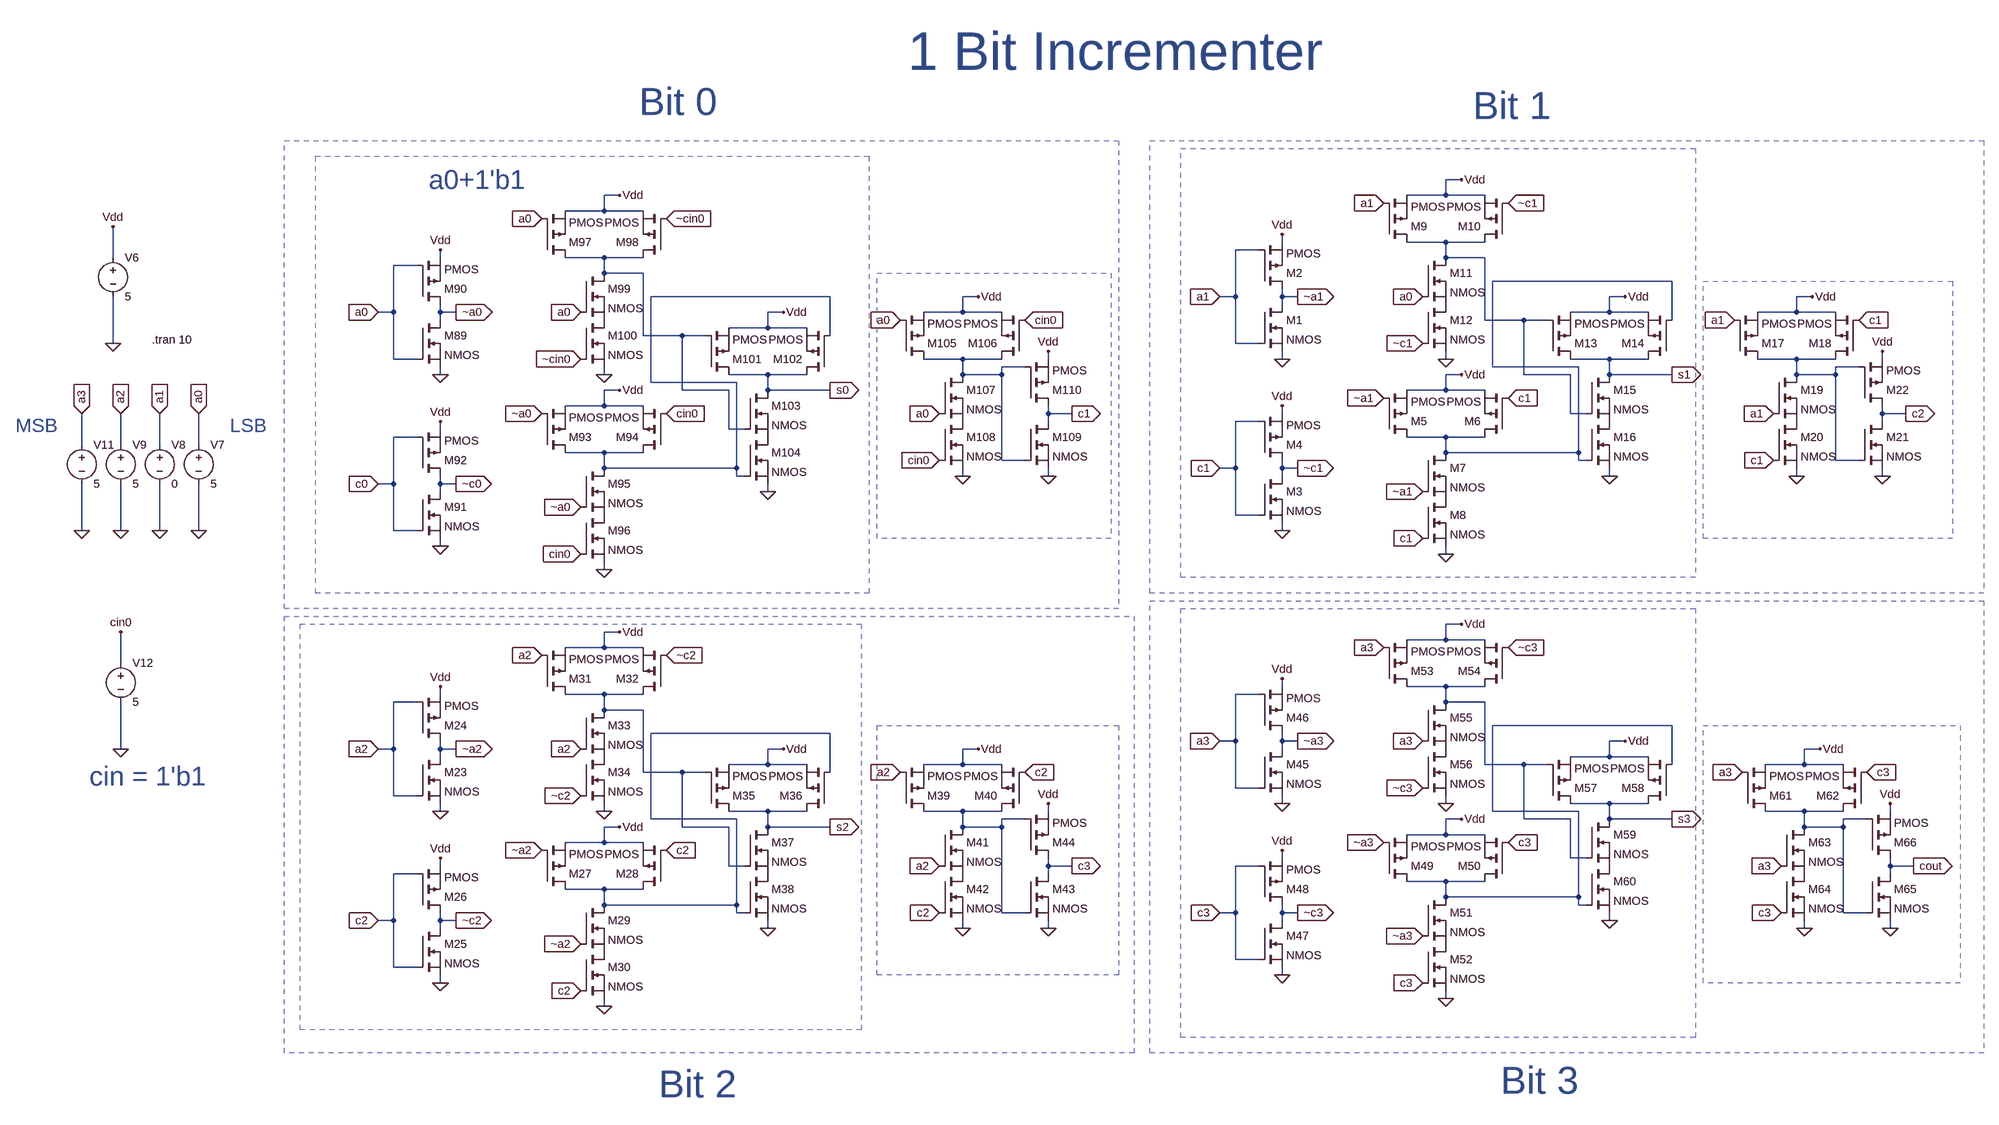
[diagram p0: schematic 1 bit Incrementer.asc]
1 bit Incrementer.asc, the LTspice schematic file:
Version 4
SHEET 1 2804 1276
WIRE 1728 -2720 1696 -2720
WIRE 0 -2688 -32 -2688
WIRE 1696 -2688 1696 -2720
WIRE 1696 -2688 1616 -2688
WIRE 1776 -2688 1696 -2688
WIRE -32 -2656 -32 -2688
WIRE -32 -2656 -112 -2656
WIRE 48 -2656 -32 -2656
WIRE 1360 -2592 1360 -2608
WIRE 1696 -2592 1616 -2592
WIRE 1776 -2592 1696 -2592
WIRE 1312 -2576 1264 -2576
WIRE -1040 -2560 -1040 -2624
WIRE -368 -2560 -368 -2576
WIRE -32 -2560 -112 -2560
WIRE 48 -2560 -32 -2560
WIRE 1696 -2560 1696 -2592
WIRE 1776 -2560 1696 -2560
WIRE -416 -2544 -464 -2544
WIRE -32 -2528 -32 -2560
WIRE 48 -2528 -32 -2528
WIRE 2160 -2512 1792 -2512
WIRE 432 -2480 64 -2480
WIRE 736 -2480 704 -2480
WIRE 1264 -2480 1264 -2576
WIRE 1264 -2480 1232 -2480
WIRE 1360 -2480 1360 -2496
WIRE 1392 -2480 1360 -2480
WIRE 2064 -2480 2032 -2480
WIRE 2448 -2480 2416 -2480
WIRE 1360 -2464 1360 -2480
WIRE -464 -2448 -464 -2544
WIRE -464 -2448 -496 -2448
WIRE -368 -2448 -368 -2464
WIRE -336 -2448 -368 -2448
WIRE 336 -2448 304 -2448
WIRE 704 -2448 704 -2480
WIRE 704 -2448 624 -2448
WIRE 784 -2448 704 -2448
WIRE 2032 -2448 2032 -2480
WIRE 2032 -2448 1952 -2448
WIRE 2112 -2448 2032 -2448
WIRE 2416 -2448 2416 -2480
WIRE 2416 -2448 2336 -2448
WIRE 2496 -2448 2416 -2448
WIRE -368 -2432 -368 -2448
WIRE 1776 -2432 1776 -2560
WIRE 1856 -2432 1776 -2432
WIRE 1904 -2432 1856 -2432
WIRE 2160 -2432 2160 -2512
WIRE 304 -2416 304 -2448
WIRE 304 -2416 224 -2416
WIRE 384 -2416 304 -2416
WIRE 48 -2400 48 -2528
WIRE 128 -2400 48 -2400
WIRE 176 -2400 128 -2400
WIRE 432 -2400 432 -2480
WIRE -1040 -2384 -1040 -2480
WIRE 1264 -2384 1264 -2480
WIRE 1312 -2384 1264 -2384
WIRE -464 -2352 -464 -2448
WIRE -416 -2352 -464 -2352
WIRE 704 -2352 624 -2352
WIRE 784 -2352 704 -2352
WIRE 880 -2352 880 -2368
WIRE 1360 -2352 1360 -2368
WIRE 1696 -2352 1696 -2368
WIRE 2032 -2352 1952 -2352
WIRE 2112 -2352 2032 -2352
WIRE 2416 -2352 2336 -2352
WIRE 2496 -2352 2416 -2352
WIRE 2592 -2352 2592 -2368
WIRE 832 -2336 784 -2336
WIRE 1792 -2336 1792 -2512
WIRE 1968 -2336 1792 -2336
WIRE 2544 -2336 2496 -2336
WIRE -368 -2320 -368 -2336
WIRE -32 -2320 -32 -2336
WIRE 304 -2320 224 -2320
WIRE 384 -2320 304 -2320
WIRE 704 -2320 704 -2352
WIRE 784 -2320 784 -2336
WIRE 784 -2320 704 -2320
WIRE 1728 -2320 1696 -2320
WIRE 1856 -2320 1856 -2432
WIRE 1952 -2320 1856 -2320
WIRE 2032 -2320 2032 -2352
WIRE 2160 -2320 2032 -2320
WIRE 2416 -2320 2416 -2352
WIRE 2496 -2320 2496 -2336
WIRE 2496 -2320 2416 -2320
WIRE 64 -2304 64 -2480
WIRE 240 -2304 64 -2304
WIRE 0 -2288 -32 -2288
WIRE 128 -2288 128 -2400
WIRE 224 -2288 128 -2288
WIRE 304 -2288 304 -2320
WIRE 432 -2288 304 -2288
WIRE 1696 -2288 1696 -2320
WIRE 1696 -2288 1616 -2288
WIRE 1776 -2288 1696 -2288
WIRE -32 -2256 -32 -2288
WIRE -32 -2256 -112 -2256
WIRE 48 -2256 -32 -2256
WIRE 880 -2240 880 -2256
WIRE 928 -2240 880 -2240
WIRE 1360 -2240 1360 -2256
WIRE 1952 -2240 1952 -2320
WIRE 1984 -2240 1952 -2240
WIRE 2592 -2240 2592 -2256
WIRE 2640 -2240 2592 -2240
WIRE 880 -2224 880 -2240
WIRE 1312 -2224 1264 -2224
WIRE 2592 -2224 2592 -2240
WIRE -368 -2208 -368 -2224
WIRE 224 -2208 224 -2288
WIRE 256 -2208 224 -2208
WIRE -416 -2192 -464 -2192
WIRE 1696 -2192 1616 -2192
WIRE 1776 -2192 1696 -2192
WIRE -1104 -2176 -1104 -2240
WIRE -1024 -2176 -1024 -2240
WIRE -944 -2176 -944 -2240
WIRE -864 -2176 -864 -2240
WIRE -32 -2160 -112 -2160
WIRE 48 -2160 -32 -2160
WIRE 1696 -2160 1696 -2192
WIRE 1968 -2160 1968 -2336
WIRE 1968 -2160 1696 -2160
WIRE 784 -2144 784 -2320
WIRE 832 -2144 784 -2144
WIRE 1968 -2144 1968 -2160
WIRE 1984 -2144 1968 -2144
WIRE 2496 -2144 2496 -2320
WIRE 2544 -2144 2496 -2144
WIRE -32 -2128 -32 -2160
WIRE 240 -2128 240 -2304
WIRE 240 -2128 -32 -2128
WIRE 1264 -2128 1264 -2224
WIRE 1264 -2128 1232 -2128
WIRE 1360 -2128 1360 -2144
WIRE 1392 -2128 1360 -2128
WIRE 240 -2112 240 -2128
WIRE 256 -2112 240 -2112
WIRE 704 -2112 704 -2128
WIRE 880 -2112 880 -2128
WIRE 1360 -2112 1360 -2128
WIRE 2032 -2112 2032 -2128
WIRE 2416 -2112 2416 -2128
WIRE 2592 -2112 2592 -2128
WIRE -464 -2096 -464 -2192
WIRE -464 -2096 -496 -2096
WIRE -368 -2096 -368 -2112
WIRE -336 -2096 -368 -2096
WIRE -368 -2080 -368 -2096
WIRE 304 -2080 304 -2096
WIRE 1264 -2032 1264 -2128
WIRE 1312 -2032 1264 -2032
WIRE -1104 -2000 -1104 -2096
WIRE -1024 -2000 -1024 -2096
WIRE -944 -2000 -944 -2096
WIRE -864 -2000 -864 -2096
WIRE -464 -2000 -464 -2096
WIRE -416 -2000 -464 -2000
WIRE 1360 -2000 1360 -2016
WIRE -368 -1968 -368 -1984
WIRE 1696 -1952 1696 -1968
WIRE -32 -1920 -32 -1936
WIRE 1728 -1808 1696 -1808
WIRE 0 -1792 -32 -1792
WIRE 1696 -1776 1696 -1808
WIRE 1696 -1776 1616 -1776
WIRE 1776 -1776 1696 -1776
WIRE -32 -1760 -32 -1792
WIRE -32 -1760 -112 -1760
WIRE 48 -1760 -32 -1760
WIRE -1024 -1728 -1024 -1792
WIRE 1360 -1680 1360 -1696
WIRE 1696 -1680 1616 -1680
WIRE 1776 -1680 1696 -1680
WIRE -368 -1664 -368 -1680
WIRE -32 -1664 -112 -1664
WIRE 48 -1664 -32 -1664
WIRE 1312 -1664 1264 -1664
WIRE -416 -1648 -464 -1648
WIRE 1696 -1648 1696 -1680
WIRE 1776 -1648 1696 -1648
WIRE -32 -1632 -32 -1664
WIRE 48 -1632 -32 -1632
WIRE 2160 -1600 1792 -1600
WIRE 432 -1584 64 -1584
WIRE 1264 -1568 1264 -1664
WIRE 1264 -1568 1232 -1568
WIRE 1360 -1568 1360 -1584
WIRE 1392 -1568 1360 -1568
WIRE 2064 -1568 2032 -1568
WIRE -1024 -1552 -1024 -1648
WIRE -464 -1552 -464 -1648
WIRE -464 -1552 -496 -1552
WIRE -368 -1552 -368 -1568
WIRE -336 -1552 -368 -1552
WIRE 336 -1552 304 -1552
WIRE 736 -1552 704 -1552
WIRE 1360 -1552 1360 -1568
WIRE 2464 -1552 2432 -1552
WIRE -368 -1536 -368 -1552
WIRE 2032 -1536 2032 -1568
WIRE 2032 -1536 1952 -1536
WIRE 2112 -1536 2032 -1536
WIRE 304 -1520 304 -1552
WIRE 304 -1520 224 -1520
WIRE 384 -1520 304 -1520
WIRE 704 -1520 704 -1552
WIRE 704 -1520 624 -1520
WIRE 784 -1520 704 -1520
WIRE 1776 -1520 1776 -1648
WIRE 1856 -1520 1776 -1520
WIRE 1904 -1520 1856 -1520
WIRE 2160 -1520 2160 -1600
WIRE 2432 -1520 2432 -1552
WIRE 2432 -1520 2352 -1520
WIRE 2512 -1520 2432 -1520
WIRE 48 -1504 48 -1632
WIRE 128 -1504 48 -1504
WIRE 176 -1504 128 -1504
WIRE 432 -1504 432 -1584
WIRE 1264 -1472 1264 -1568
WIRE 1312 -1472 1264 -1472
WIRE -464 -1456 -464 -1552
WIRE -416 -1456 -464 -1456
WIRE 1360 -1440 1360 -1456
WIRE 1696 -1440 1696 -1456
WIRE 2032 -1440 1952 -1440
WIRE 2112 -1440 2032 -1440
WIRE -368 -1424 -368 -1440
WIRE -32 -1424 -32 -1440
WIRE 304 -1424 224 -1424
WIRE 384 -1424 304 -1424
WIRE 704 -1424 624 -1424
WIRE 784 -1424 704 -1424
WIRE 880 -1424 880 -1440
WIRE 1792 -1424 1792 -1600
WIRE 1968 -1424 1792 -1424
WIRE 2432 -1424 2352 -1424
WIRE 2512 -1424 2432 -1424
WIRE 2608 -1424 2608 -1440
WIRE 64 -1408 64 -1584
WIRE 240 -1408 64 -1408
WIRE 832 -1408 784 -1408
WIRE 1728 -1408 1696 -1408
WIRE 1856 -1408 1856 -1520
WIRE 1952 -1408 1856 -1408
WIRE 2032 -1408 2032 -1440
WIRE 2160 -1408 2032 -1408
WIRE 2560 -1408 2512 -1408
WIRE 0 -1392 -32 -1392
WIRE 128 -1392 128 -1504
WIRE 224 -1392 128 -1392
WIRE 304 -1392 304 -1424
WIRE 432 -1392 304 -1392
WIRE 704 -1392 704 -1424
WIRE 784 -1392 784 -1408
WIRE 784 -1392 704 -1392
WIRE 2432 -1392 2432 -1424
WIRE 2512 -1392 2512 -1408
WIRE 2512 -1392 2432 -1392
WIRE 1696 -1376 1696 -1408
WIRE 1696 -1376 1616 -1376
WIRE 1776 -1376 1696 -1376
WIRE -32 -1360 -32 -1392
WIRE -32 -1360 -112 -1360
WIRE 48 -1360 -32 -1360
WIRE 1360 -1328 1360 -1344
WIRE 1952 -1328 1952 -1408
WIRE 1984 -1328 1952 -1328
WIRE -368 -1312 -368 -1328
WIRE 224 -1312 224 -1392
WIRE 256 -1312 224 -1312
WIRE 880 -1312 880 -1328
WIRE 928 -1312 880 -1312
WIRE 1312 -1312 1264 -1312
WIRE 2608 -1312 2608 -1328
WIRE 2656 -1312 2608 -1312
WIRE -416 -1296 -464 -1296
WIRE 880 -1296 880 -1312
WIRE 2608 -1296 2608 -1312
WIRE 1696 -1280 1616 -1280
WIRE 1776 -1280 1696 -1280
WIRE -32 -1264 -112 -1264
WIRE 48 -1264 -32 -1264
WIRE 1696 -1248 1696 -1280
WIRE 1968 -1248 1968 -1424
WIRE 1968 -1248 1696 -1248
WIRE -32 -1232 -32 -1264
WIRE 240 -1232 240 -1408
WIRE 240 -1232 -32 -1232
WIRE 1968 -1232 1968 -1248
WIRE 1984 -1232 1968 -1232
WIRE 240 -1216 240 -1232
WIRE 256 -1216 240 -1216
WIRE 784 -1216 784 -1392
WIRE 832 -1216 784 -1216
WIRE 1264 -1216 1264 -1312
WIRE 1264 -1216 1232 -1216
WIRE 1360 -1216 1360 -1232
WIRE 1392 -1216 1360 -1216
WIRE 2512 -1216 2512 -1392
WIRE 2560 -1216 2512 -1216
WIRE -464 -1200 -464 -1296
WIRE -464 -1200 -496 -1200
WIRE -368 -1200 -368 -1216
WIRE -336 -1200 -368 -1200
WIRE 1360 -1200 1360 -1216
WIRE 2032 -1200 2032 -1216
WIRE -368 -1184 -368 -1200
WIRE 304 -1184 304 -1200
WIRE 704 -1184 704 -1200
WIRE 880 -1184 880 -1200
WIRE 2432 -1184 2432 -1200
WIRE 2608 -1184 2608 -1200
WIRE 1264 -1120 1264 -1216
WIRE 1312 -1120 1264 -1120
WIRE -464 -1104 -464 -1200
WIRE -416 -1104 -464 -1104
WIRE 1360 -1088 1360 -1104
WIRE -368 -1072 -368 -1088
WIRE 1696 -1040 1696 -1056
WIRE -32 -1024 -32 -1040
FLAG -368 -2320 0
FLAG -368 -2576 Vdd
FLAG -336 -2448 ~a0
IOPIN -336 -2448 Out
FLAG -496 -2448 a0
IOPIN -496 -2448 In
FLAG -368 -1968 0
FLAG -368 -2224 Vdd
FLAG -336 -2096 ~c0
IOPIN -336 -2096 Out
FLAG -496 -2096 c0
IOPIN -496 -2096 In
FLAG 0 -2288 Vdd
FLAG -32 -1920 0
FLAG -80 -2048 ~a0
IOPIN -80 -2048 In
FLAG 96 -2240 cin0
IOPIN 96 -2240 In
FLAG -80 -1952 cin0
IOPIN -80 -1952 In
FLAG -160 -2240 ~a0
IOPIN -160 -2240 In
FLAG 0 -2688 Vdd
FLAG -32 -2320 0
FLAG -80 -2448 a0
IOPIN -80 -2448 In
FLAG 96 -2640 ~cin0
IOPIN 96 -2640 In
FLAG -80 -2352 ~cin0
IOPIN -80 -2352 In
FLAG -160 -2640 a0
IOPIN -160 -2640 In
FLAG 336 -2448 Vdd
FLAG 304 -2080 0
FLAG 432 -2288 s0
IOPIN 432 -2288 Out
FLAG 736 -2480 Vdd
FLAG 704 -2112 0
FLAG 656 -2240 a0
IOPIN 656 -2240 In
FLAG 832 -2432 cin0
IOPIN 832 -2432 In
FLAG 576 -2432 a0
IOPIN 576 -2432 In
FLAG 656 -2144 cin0
IOPIN 656 -2144 In
FLAG 880 -2112 0
FLAG 880 -2368 Vdd
FLAG 928 -2240 c1
IOPIN 928 -2240 Out
FLAG -1040 -2384 0
FLAG -1040 -2624 Vdd
FLAG -864 -2000 0
FLAG -864 -2240 a0
IOPIN -864 -2240 In
FLAG -944 -2000 0
FLAG -944 -2240 a1
IOPIN -944 -2240 In
FLAG -1024 -2000 0
FLAG -1024 -2240 a2
IOPIN -1024 -2240 In
FLAG -1104 -2000 0
FLAG -1104 -2240 a3
IOPIN -1104 -2240 In
FLAG -1024 -1552 0
FLAG -1024 -1792 cin0
FLAG 1360 -2352 0
FLAG 1360 -2608 Vdd
FLAG 1392 -2480 ~a1
IOPIN 1392 -2480 Out
FLAG 1232 -2480 a1
IOPIN 1232 -2480 In
FLAG 1360 -2000 0
FLAG 1360 -2256 Vdd
FLAG 1392 -2128 ~c1
IOPIN 1392 -2128 Out
FLAG 1232 -2128 c1
IOPIN 1232 -2128 In
FLAG 1728 -2320 Vdd
FLAG 1696 -1952 0
FLAG 1648 -2080 ~a1
IOPIN 1648 -2080 In
FLAG 1824 -2272 c1
IOPIN 1824 -2272 In
FLAG 1648 -1984 c1
IOPIN 1648 -1984 In
FLAG 1568 -2272 ~a1
IOPIN 1568 -2272 In
FLAG 1728 -2720 Vdd
FLAG 1696 -2352 0
FLAG 1648 -2480 a0
IOPIN 1648 -2480 In
FLAG 1824 -2672 ~c1
IOPIN 1824 -2672 In
FLAG 1648 -2384 ~c1
IOPIN 1648 -2384 In
FLAG 1568 -2672 a1
IOPIN 1568 -2672 In
FLAG 2064 -2480 Vdd
FLAG 2032 -2112 0
FLAG 2160 -2320 s1
IOPIN 2160 -2320 Out
FLAG 2448 -2480 Vdd
FLAG 2416 -2112 0
FLAG 2368 -2240 a1
IOPIN 2368 -2240 In
FLAG 2544 -2432 c1
IOPIN 2544 -2432 In
FLAG 2288 -2432 a1
IOPIN 2288 -2432 In
FLAG 2368 -2144 c1
IOPIN 2368 -2144 In
FLAG 2592 -2112 0
FLAG 2592 -2368 Vdd
FLAG 2640 -2240 c2
IOPIN 2640 -2240 Out
FLAG -368 -1424 0
FLAG -368 -1680 Vdd
FLAG -336 -1552 ~a2
IOPIN -336 -1552 Out
FLAG -496 -1552 a2
IOPIN -496 -1552 In
FLAG -368 -1072 0
FLAG -368 -1328 Vdd
FLAG -336 -1200 ~c2
IOPIN -336 -1200 Out
FLAG -496 -1200 c2
IOPIN -496 -1200 In
FLAG 0 -1392 Vdd
FLAG -32 -1024 0
FLAG -80 -1152 ~a2
IOPIN -80 -1152 In
FLAG 96 -1344 c2
IOPIN 96 -1344 In
FLAG -80 -1056 c2
IOPIN -80 -1056 In
FLAG -160 -1344 ~a2
IOPIN -160 -1344 In
FLAG 0 -1792 Vdd
FLAG -32 -1424 0
FLAG -80 -1552 a2
IOPIN -80 -1552 In
FLAG 96 -1744 ~c2
IOPIN 96 -1744 In
FLAG -80 -1456 ~c2
IOPIN -80 -1456 In
FLAG -160 -1744 a2
IOPIN -160 -1744 In
FLAG 336 -1552 Vdd
FLAG 304 -1184 0
FLAG 432 -1392 s2
IOPIN 432 -1392 Out
FLAG 736 -1552 Vdd
FLAG 704 -1184 0
FLAG 656 -1312 a2
IOPIN 656 -1312 In
FLAG 832 -1504 c2
IOPIN 832 -1504 In
FLAG 576 -1504 a2
IOPIN 576 -1504 In
FLAG 656 -1216 c2
IOPIN 656 -1216 In
FLAG 880 -1184 0
FLAG 880 -1440 Vdd
FLAG 928 -1312 c3
IOPIN 928 -1312 Out
FLAG 1360 -1440 0
FLAG 1360 -1696 Vdd
FLAG 1392 -1568 ~a3
IOPIN 1392 -1568 Out
FLAG 1232 -1568 a3
IOPIN 1232 -1568 In
FLAG 1360 -1088 0
FLAG 1360 -1344 Vdd
FLAG 1392 -1216 ~c3
IOPIN 1392 -1216 Out
FLAG 1232 -1216 c3
IOPIN 1232 -1216 In
FLAG 1728 -1408 Vdd
FLAG 1696 -1040 0
FLAG 1648 -1168 ~a3
IOPIN 1648 -1168 In
FLAG 1824 -1360 c3
IOPIN 1824 -1360 In
FLAG 1648 -1072 c3
IOPIN 1648 -1072 In
FLAG 1568 -1360 ~a3
IOPIN 1568 -1360 In
FLAG 1728 -1808 Vdd
FLAG 1696 -1440 0
FLAG 1648 -1568 a3
IOPIN 1648 -1568 In
FLAG 1824 -1760 ~c3
IOPIN 1824 -1760 In
FLAG 1648 -1472 ~c3
IOPIN 1648 -1472 In
FLAG 1568 -1760 a3
IOPIN 1568 -1760 In
FLAG 2064 -1568 Vdd
FLAG 2032 -1200 0
FLAG 2160 -1408 s3
IOPIN 2160 -1408 Out
FLAG 2464 -1552 Vdd
FLAG 2432 -1184 0
FLAG 2384 -1312 a3
IOPIN 2384 -1312 In
FLAG 2560 -1504 c3
IOPIN 2560 -1504 In
FLAG 2304 -1504 a3
IOPIN 2304 -1504 In
FLAG 2384 -1216 c3
IOPIN 2384 -1216 In
FLAG 2608 -1184 0
FLAG 2608 -1440 Vdd
FLAG 2656 -1312 cout
IOPIN 2656 -1312 Out
SYMBOL nmos -416 -2432 R0
SYMATTR InstName M89
SYMBOL pmos -416 -2464 M180
SYMATTR InstName M90
SYMBOL nmos -416 -2080 R0
SYMATTR InstName M91
SYMBOL pmos -416 -2112 M180
SYMATTR InstName M92
SYMBOL pmos -160 -2160 M180
SYMATTR InstName M93
SYMBOL pmos 96 -2160 R180
SYMATTR InstName M94
SYMBOL nmos -80 -2128 R0
SYMATTR InstName M95
SYMBOL nmos -80 -2032 R0
SYMATTR InstName M96
SYMBOL pmos -160 -2560 M180
SYMATTR InstName M97
SYMBOL pmos 96 -2560 R180
SYMATTR InstName M98
SYMBOL nmos -80 -2528 R0
SYMATTR InstName M99
SYMBOL nmos -80 -2432 R0
SYMATTR InstName M100
SYMBOL pmos 176 -2320 M180
SYMATTR InstName M101
SYMBOL pmos 432 -2320 R180
SYMATTR InstName M102
SYMBOL nmos 256 -2288 R0
SYMATTR InstName M103
SYMBOL nmos 256 -2192 R0
SYMATTR InstName M104
SYMBOL pmos 576 -2352 M180
SYMATTR InstName M105
SYMBOL pmos 832 -2352 R180
SYMATTR InstName M106
SYMBOL nmos 656 -2320 R0
SYMATTR InstName M107
SYMBOL nmos 656 -2224 R0
SYMATTR InstName M108
SYMBOL nmos 832 -2224 R0
SYMATTR InstName M109
SYMBOL pmos 832 -2256 M180
SYMATTR InstName M110
SYMBOL voltage -1040 -2576 R0
SYMATTR InstName V6
SYMATTR Value 5
SYMBOL voltage -864 -2192 R0
SYMATTR InstName V7
SYMATTR Value 5
SYMBOL voltage -944 -2192 R0
SYMATTR InstName V8
SYMATTR Value 0
SYMBOL voltage -1024 -2192 R0
SYMATTR InstName V9
SYMATTR Value 5
SYMBOL voltage -1104 -2192 R0
SYMATTR InstName V11
SYMATTR Value 5
SYMBOL voltage -1024 -1744 R0
SYMATTR InstName V12
SYMATTR Value 5
SYMBOL nmos 1312 -2464 R0
SYMATTR InstName M1
SYMBOL pmos 1312 -2496 M180
SYMATTR InstName M2
SYMBOL nmos 1312 -2112 R0
SYMATTR InstName M3
SYMBOL pmos 1312 -2144 M180
SYMATTR InstName M4
SYMBOL pmos 1568 -2192 M180
SYMATTR InstName M5
SYMBOL pmos 1824 -2192 R180
SYMATTR InstName M6
SYMBOL nmos 1648 -2160 R0
SYMATTR InstName M7
SYMBOL nmos 1648 -2064 R0
SYMATTR InstName M8
SYMBOL pmos 1568 -2592 M180
SYMATTR InstName M9
SYMBOL pmos 1824 -2592 R180
SYMATTR InstName M10
SYMBOL nmos 1648 -2560 R0
SYMATTR InstName M11
SYMBOL nmos 1648 -2464 R0
SYMATTR InstName M12
SYMBOL pmos 1904 -2352 M180
SYMATTR InstName M13
SYMBOL pmos 2160 -2352 R180
SYMATTR InstName M14
SYMBOL nmos 1984 -2320 R0
SYMATTR InstName M15
SYMBOL nmos 1984 -2224 R0
SYMATTR InstName M16
SYMBOL pmos 2288 -2352 M180
SYMATTR InstName M17
SYMBOL pmos 2544 -2352 R180
SYMATTR InstName M18
SYMBOL nmos 2368 -2320 R0
SYMATTR InstName M19
SYMBOL nmos 2368 -2224 R0
SYMATTR InstName M20
SYMBOL nmos 2544 -2224 R0
SYMATTR InstName M21
SYMBOL pmos 2544 -2256 M180
SYMATTR InstName M22
SYMBOL nmos -416 -1536 R0
SYMATTR InstName M23
SYMBOL pmos -416 -1568 M180
SYMATTR InstName M24
SYMBOL nmos -416 -1184 R0
SYMATTR InstName M25
SYMBOL pmos -416 -1216 M180
SYMATTR InstName M26
SYMBOL pmos -160 -1264 M180
SYMATTR InstName M27
SYMBOL pmos 96 -1264 R180
SYMATTR InstName M28
SYMBOL nmos -80 -1232 R0
SYMATTR InstName M29
SYMBOL nmos -80 -1136 R0
SYMATTR InstName M30
SYMBOL pmos -160 -1664 M180
SYMATTR InstName M31
SYMBOL pmos 96 -1664 R180
SYMATTR InstName M32
SYMBOL nmos -80 -1632 R0
SYMATTR InstName M33
SYMBOL nmos -80 -1536 R0
SYMATTR InstName M34
SYMBOL pmos 176 -1424 M180
SYMATTR InstName M35
SYMBOL pmos 432 -1424 R180
SYMATTR InstName M36
SYMBOL nmos 256 -1392 R0
SYMATTR InstName M37
SYMBOL nmos 256 -1296 R0
SYMATTR InstName M38
SYMBOL pmos 576 -1424 M180
SYMATTR InstName M39
SYMBOL pmos 832 -1424 R180
SYMATTR InstName M40
SYMBOL nmos 656 -1392 R0
SYMATTR InstName M41
SYMBOL nmos 656 -1296 R0
SYMATTR InstName M42
SYMBOL nmos 832 -1296 R0
SYMATTR InstName M43
SYMBOL pmos 832 -1328 M180
SYMATTR InstName M44
SYMBOL nmos 1312 -1552 R0
SYMATTR InstName M45
SYMBOL pmos 1312 -1584 M180
SYMATTR InstName M46
SYMBOL nmos 1312 -1200 R0
SYMATTR InstName M47
SYMBOL pmos 1312 -1232 M180
SYMATTR InstName M48
SYMBOL pmos 1568 -1280 M180
SYMATTR InstName M49
SYMBOL pmos 1824 -1280 R180
SYMATTR InstName M50
SYMBOL nmos 1648 -1248 R0
SYMATTR InstName M51
SYMBOL nmos 1648 -1152 R0
SYMATTR InstName M52
SYMBOL pmos 1568 -1680 M180
SYMATTR InstName M53
SYMBOL pmos 1824 -1680 R180
SYMATTR InstName M54
SYMBOL nmos 1648 -1648 R0
SYMATTR InstName M55
SYMBOL nmos 1648 -1552 R0
SYMATTR InstName M56
SYMBOL pmos 1904 -1440 M180
SYMATTR InstName M57
SYMBOL pmos 2160 -1440 R180
SYMATTR InstName M58
SYMBOL nmos 1984 -1408 R0
SYMATTR InstName M59
SYMBOL nmos 1984 -1312 R0
SYMATTR InstName M60
SYMBOL pmos 2304 -1424 M180
SYMATTR InstName M61
SYMBOL pmos 2560 -1424 R180
SYMATTR InstName M62
SYMBOL nmos 2384 -1392 R0
SYMATTR InstName M63
SYMBOL nmos 2384 -1296 R0
SYMATTR InstName M64
SYMBOL nmos 2560 -1296 R0
SYMATTR InstName M65
SYMBOL pmos 2560 -1328 M180
SYMATTR InstName M66
TEXT -960 -2392 Left 2 !.tran 10
TEXT -800 -2216 Left 4 ;LSB
TEXT -1240 -2216 Left 4 ;MSB
TEXT -392 -2720 Left 5 ;a0+1'b1
TEXT -1088 -1496 Left 5 ;cin = 1'b1
TEXT 40 -2880 Left 6 ;Bit 0
TEXT 1752 -2872 Left 6 ;Bit 1
TEXT 80 -864 Left 6 ;Bit 2
TEXT 1808 -872 Left 6 ;Bit 3
TEXT 592 -2984 Left 7 ;1 Bit Incrementer
RECTANGLE Normal 512 -1872 -624 -2768 2
RECTANGLE Normal 1008 -1984 528 -2528 2
RECTANGLE Normal 1152 -2784 1152 -2784 2
RECTANGLE Normal 2208 -1904 1152 -2784 2
RECTANGLE Normal 2736 -1984 2224 -2512 2
RECTANGLE Normal 496 -976 -656 -1808 2
RECTANGLE Normal 1024 -1088 528 -1600 2
RECTANGLE Normal 2208 -960 1152 -1840 2
RECTANGLE Normal 2752 -1072 2224 -1600 2
RECTANGLE Normal 1024 -1840 -688 -2800 3
RECTANGLE Normal 2800 -1872 1088 -2800 3
RECTANGLE Normal 1056 -928 -688 -1824 3
RECTANGLE Normal 2800 -928 1088 -1856 3

The netlist it stands for:
* 1 bit Incrementer.asc
M89 ~a0 a0 0 0 NMOS
M90 ~a0 a0 Vdd Vdd PMOS
M91 ~c0 c0 0 0 NMOS
M92 ~c0 c0 Vdd Vdd PMOS
M93 N004 ~a0 Vdd Vdd PMOS
M94 N004 cin0 Vdd Vdd PMOS
M95 N004 ~a0 P001 P001 NMOS
M96 P001 cin0 0 0 NMOS
M97 N002 a0 Vdd Vdd PMOS
M98 N002 ~cin0 Vdd Vdd PMOS
M99 N002 a0 P002 P002 NMOS
M100 P002 ~cin0 0 0 NMOS
M101 s0 N002 Vdd Vdd PMOS
M102 s0 N004 Vdd Vdd PMOS
M103 s0 N002 P003 P003 NMOS
M104 P003 N004 0 0 NMOS
M105 N005 a0 Vdd Vdd PMOS
M106 N005 cin0 Vdd Vdd PMOS
M107 N005 a0 P004 P004 NMOS
M108 P004 cin0 0 0 NMOS
M109 c1 N005 0 0 NMOS
M110 c1 N005 Vdd Vdd PMOS
V6 Vdd 0 5
V7 a0 0 5
V8 a1 0 0
V9 a2 0 5
V11 a3 0 5
V12 cin0 0 5
M1 ~a1 a1 0 0 NMOS
M2 ~a1 a1 Vdd Vdd PMOS
M3 ~c1 c1 0 0 NMOS
M4 ~c1 c1 Vdd Vdd PMOS
M5 N003 ~a1 Vdd Vdd PMOS
M6 N003 c1 Vdd Vdd PMOS
M7 N003 ~a1 P005 P005 NMOS
M8 P005 c1 0 0 NMOS
M9 N001 a1 Vdd Vdd PMOS
M10 N001 ~c1 Vdd Vdd PMOS
M11 N001 a0 P006 P006 NMOS
M12 P006 ~c1 0 0 NMOS
M13 s1 N001 Vdd Vdd PMOS
M14 s1 N003 Vdd Vdd PMOS
M15 s1 N001 P007 P007 NMOS
M16 P007 N003 0 0 NMOS
M17 N006 a1 Vdd Vdd PMOS
M18 N006 c1 Vdd Vdd PMOS
M19 N006 a1 P008 P008 NMOS
M20 P008 c1 0 0 NMOS
M21 c2 N006 0 0 NMOS
M22 c2 N006 Vdd Vdd PMOS
M23 ~a2 a2 0 0 NMOS
M24 ~a2 a2 Vdd Vdd PMOS
M25 ~c2 c2 0 0 NMOS
M26 ~c2 c2 Vdd Vdd PMOS
M27 N010 ~a2 Vdd Vdd PMOS
M28 N010 c2 Vdd Vdd PMOS
M29 N010 ~a2 P009 P009 NMOS
M30 P009 c2 0 0 NMOS
M31 N008 a2 Vdd Vdd PMOS
M32 N008 ~c2 Vdd Vdd PMOS
M33 N008 a2 P010 P010 NMOS
M34 P010 ~c2 0 0 NMOS
M35 s2 N008 Vdd Vdd PMOS
M36 s2 N010 Vdd Vdd PMOS
M37 s2 N008 P011 P011 NMOS
M38 P011 N010 0 0 NMOS
M39 N011 a2 Vdd Vdd PMOS
M40 N011 c2 Vdd Vdd PMOS
M41 N011 a2 P012 P012 NMOS
M42 P012 c2 0 0 NMOS
M43 c3 N011 0 0 NMOS
M44 c3 N011 Vdd Vdd PMOS
M45 ~a3 a3 0 0 NMOS
M46 ~a3 a3 Vdd Vdd PMOS
M47 ~c3 c3 0 0 NMOS
M48 ~c3 c3 Vdd Vdd PMOS
M49 N009 ~a3 Vdd Vdd PMOS
M50 N009 c3 Vdd Vdd PMOS
M51 N009 ~a3 P013 P013 NMOS
M52 P013 c3 0 0 NMOS
M53 N007 a3 Vdd Vdd PMOS
M54 N007 ~c3 Vdd Vdd PMOS
M55 N007 a3 P014 P014 NMOS
M56 P014 ~c3 0 0 NMOS
M57 s3 N007 Vdd Vdd PMOS
M58 s3 N009 Vdd Vdd PMOS
M59 s3 N007 P015 P015 NMOS
M60 P015 N009 0 0 NMOS
M61 N012 a3 Vdd Vdd PMOS
M62 N012 c3 Vdd Vdd PMOS
M63 N012 a3 P016 P016 NMOS
M64 P016 c3 0 0 NMOS
M65 cout N012 0 0 NMOS
M66 cout N012 Vdd Vdd PMOS
.model NMOS NMOS
.model PMOS PMOS
.lib standard.mos
.tran 10
* LSB
* MSB
* a0+1'b1
* cin = 1'b1
* Bit 0
* Bit 1
* Bit 2
* Bit 3
* 1 Bit Incrementer
.backanno
.end